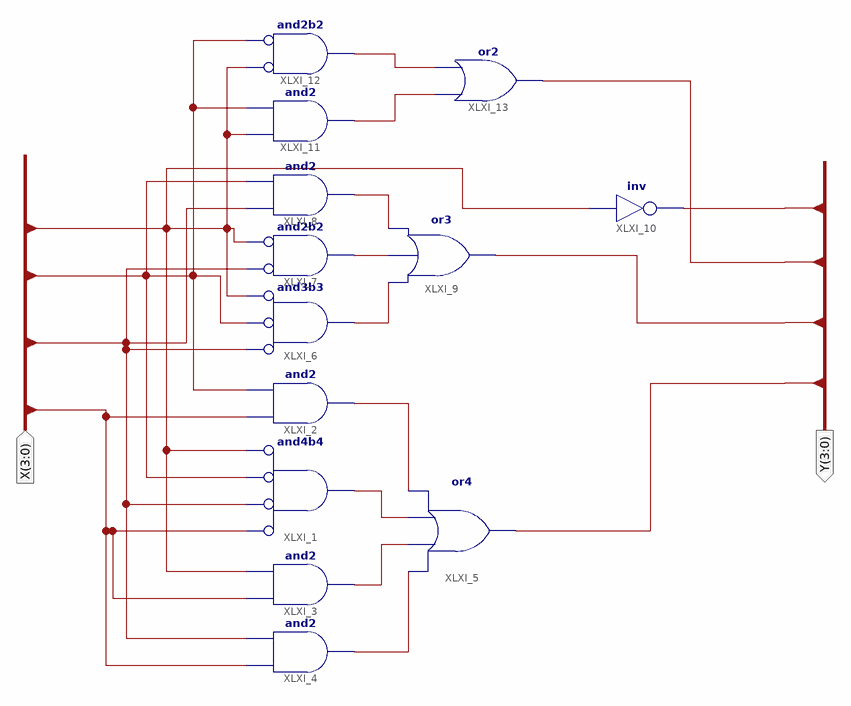
[diagram p0: schematic sheet 1]
// Xilinx ISE schematic sourcefile.sch (xc9500xl) as structural Verilog: 13 symbols, 2 ports
module sourcefile (
  input  [3:0] X,
  output [3:0] Y
);

  wire XLXN_19, XLXN_20, XLXN_21, XLXN_22, XLXN_30, XLXN_31, XLXN_32, XLXN_36, XLXN_39;

  and XLXI_1 (XLXN_20, ~X[0], ~X[1], ~X[2], ~X[3]);  // and4b4
  and XLXI_2 (XLXN_19, X[0], X[2]);
  and XLXI_3 (XLXN_21, X[0], X[3]);
  and XLXI_4 (XLXN_22, X[0], X[1]);
  or XLXI_5 (Y[0], XLXN_22, XLXN_21, XLXN_20, XLXN_19);
  and XLXI_6 (XLXN_30, ~X[1], ~X[2], ~X[3]);  // and3b3
  and XLXI_7 (XLXN_31, ~X[1], ~X[3]);  // and2b2
  and XLXI_8 (XLXN_32, X[1], X[2]);
  or XLXI_9 (Y[1], XLXN_30, XLXN_31, XLXN_32);
  not XLXI_10 (Y[3], X[3]);
  and XLXI_11 (XLXN_36, X[3], X[2]);
  and XLXI_12 (XLXN_39, ~X[3], ~X[2]);  // and2b2
  or XLXI_13 (Y[2], XLXN_36, XLXN_39);
endmodule
